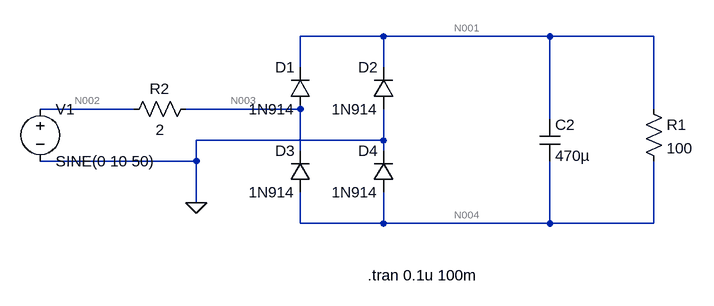
[diagram p0: schematic Draft1.asc]
Draft1.asc, the LTspice schematic file:
Version 4
SHEET 1 880 680
WIRE 256 16 128 16
WIRE 512 16 256 16
WIRE 672 16 512 16
WIRE 128 64 128 16
WIRE 256 64 256 16
WIRE -128 128 -272 128
WIRE 128 128 -48 128
WIRE 672 128 672 16
WIRE 512 144 512 16
WIRE 256 176 256 128
WIRE 256 176 -32 176
WIRE 128 192 128 128
WIRE 256 192 256 176
WIRE -32 208 -32 176
WIRE -32 208 -272 208
WIRE -32 272 -32 208
WIRE 128 304 128 256
WIRE 256 304 256 256
WIRE 256 304 128 304
WIRE 512 304 512 208
WIRE 512 304 256 304
WIRE 672 304 672 208
WIRE 672 304 512 304
FLAG -32 272 0
SYMBOL diode 144 128 R180
WINDOW 0 24 64 Left 2
WINDOW 3 24 0 Left 2
SYMATTR InstName D1
SYMATTR Value 1N914
SYMBOL diode 272 128 R180
WINDOW 0 24 64 Left 2
WINDOW 3 24 0 Left 2
SYMATTR InstName D2
SYMATTR Value 1N914
SYMBOL diode 144 256 R180
WINDOW 0 24 64 Left 2
WINDOW 3 24 0 Left 2
SYMATTR InstName D3
SYMATTR Value 1N914
SYMBOL diode 272 256 R180
WINDOW 0 24 64 Left 2
WINDOW 3 24 0 Left 2
SYMATTR InstName D4
SYMATTR Value 1N914
SYMBOL res 656 112 R0
SYMATTR InstName R1
SYMATTR Value 100
SYMATTR SpiceLine tol=1 pwr=0.1
SYMBOL voltage -272 112 R0
WINDOW 123 0 0 Left 0
WINDOW 39 24 124 Left 2
SYMATTR InstName V1
SYMATTR Value SINE(0 10 50)
SYMBOL res -32 112 R90
WINDOW 0 0 56 VBottom 2
WINDOW 3 32 56 VTop 2
SYMATTR InstName R2
SYMATTR Value 2
SYMBOL cap 496 144 R0
SYMATTR InstName C2
SYMATTR Value 470µ
TEXT 232 384 Left 2 !.tran 0.1u 100m

The netlist it stands for:
* Draft1.asc
D1 N003 N001 1N914
D2 0 N001 1N914
D3 N004 N003 1N914
D4 N004 0 1N914
R1 N001 N004 100 tol=1 pwr=0.1
V1 N002 0 SINE(0 10 50)
R2 N003 N002 2
C2 N001 N004 470µ
.model D D
.lib standard.dio
.tran 0.1u 100m
.backanno
.end

* Results of the author's LTspice run, read from the files saved beside the schematic
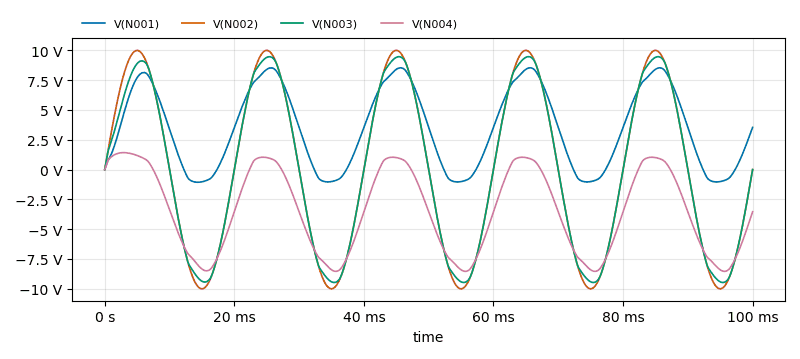
[diagram p1: Transient Analysis of Draft1.asc, plotted from the saved traces]
* Transient Analysis, 1 run:
*   V(N001): min -1.062 V, max 8.536 V, average 3.423 V, rms 4.824 V, last 3.537 V
*   V(N002): min -10 V, max 10 V, average -264.7 µV, rms 7.078 V, last 0 V
*   V(N003): min -9.471 V, max 9.471 V, average -56.77 mV, rms 6.825 V, last 2.597 µV
*   V(N004): min -8.536 V, max 1.42 V, average -3.48 V, rms 4.949 V, last -3.537 V